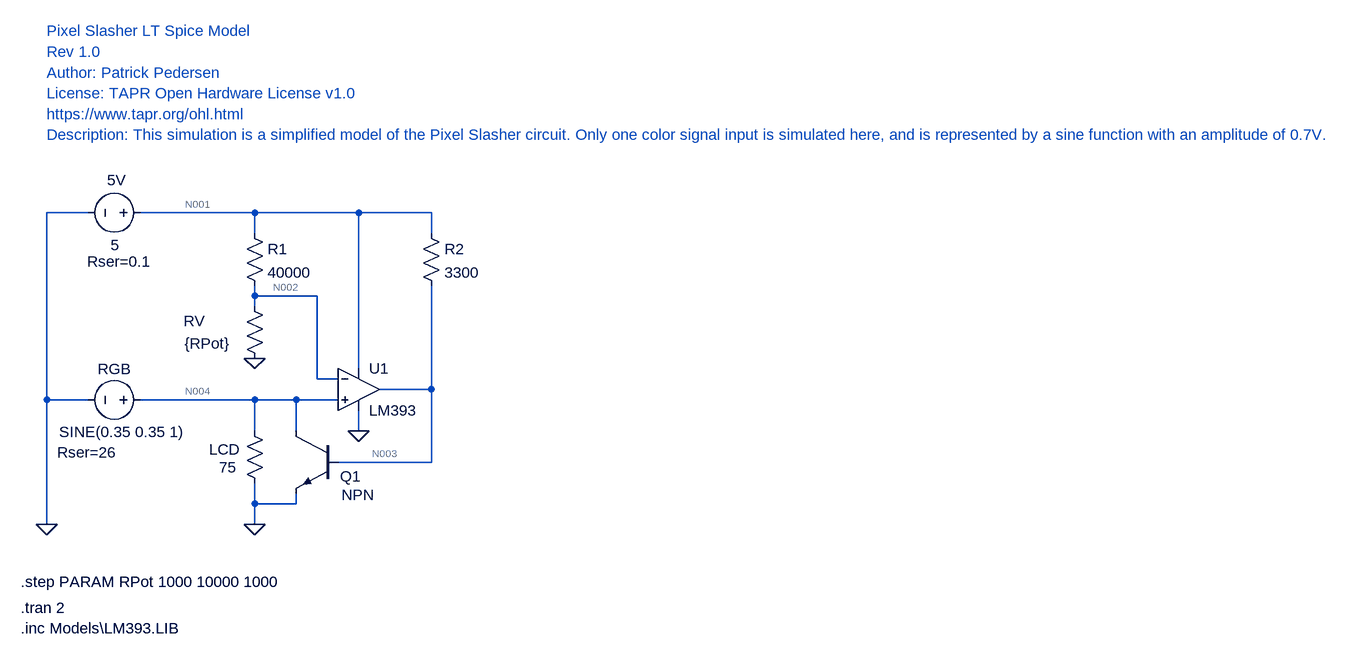
[diagram p0: schematic PixelSlasher.asc]
PixelSlasher.asc, the LTspice schematic file:
Version 4
SHEET 1 1868 688
WIRE -224 32 -288 32
WIRE 32 32 -144 32
WIRE 192 32 32 32
WIRE 304 32 192 32
WIRE 32 64 32 32
WIRE 304 64 304 32
WIRE 32 160 32 144
WIRE 128 160 32 160
WIRE 32 176 32 160
WIRE 192 272 192 32
WIRE 128 288 128 160
WIRE 160 288 128 288
WIRE 304 304 304 144
WIRE 304 304 224 304
WIRE -288 320 -288 32
WIRE -224 320 -288 320
WIRE 32 320 -144 320
WIRE 96 320 32 320
WIRE 160 320 96 320
WIRE 32 368 32 320
WIRE 96 368 96 320
WIRE 192 368 192 336
WIRE 304 416 304 304
WIRE 304 416 160 416
WIRE 32 480 32 448
WIRE 96 480 96 464
WIRE 96 480 32 480
WIRE -288 512 -288 320
WIRE 32 512 32 480
FLAG -288 512 0
FLAG 32 256 0
FLAG 192 368 0
FLAG 32 512 0
SYMBOL voltage -128 32 R90
WINDOW 0 -50 38 VRight 2
WINDOW 3 50 48 VRight 2
WINDOW 123 0 0 Left 0
WINDOW 39 75 -1 VRight 2
SYMATTR InstName 5V
SYMATTR Value 5
SYMATTR SpiceLine Rser=0.1
SYMBOL voltage -128 320 R90
WINDOW 0 -32 56 VBottom 2
WINDOW 3 34 44 VTop 2
WINDOW 123 0 0 Left 0
WINDOW 39 65 98 VTop 2
SYMATTR InstName RGB
SYMATTR Value SINE(0.35 0.35 1)
SYMATTR SpiceLine Rser=26
SYMBOL res 16 48 R0
SYMATTR InstName R1
SYMATTR Value 40000
SYMBOL res 16 160 R0
WINDOW 0 -93 39 Left 2
WINDOW 3 -92 73 Left 2
SYMATTR InstName RV
SYMATTR Value {RPot}
SYMBOL npn 160 368 M0
WINDOW 0 -36 70 Left 2
WINDOW 3 -56 98 Left 2
SYMATTR InstName Q1
SYMBOL res 16 352 R0
WINDOW 0 -54 44 Left 2
WINDOW 3 -39 72 Left 2
SYMATTR InstName LCD
SYMATTR Value 75
SYMBOL res 288 48 R0
SYMATTR InstName R2
SYMATTR Value 3300
SYMBOL Opamps\\opamp2 192 240 R0
SYMATTR InstName U1
SYMATTR Value LM393
TEXT -328 600 Left 2 !.step PARAM RPot 1000 10000 1000
TEXT -328 640 Left 2 !.tran 2
TEXT -328 672 Left 2 !.inc Models\\LM393.LIB
TEXT -288 -216 Left 2 ;Rev 1.0
TEXT -288 -248 Left 2 ;Pixel Slasher LT Spice Model
TEXT -288 -184 Left 2 ;Author: Patrick Pedersen
TEXT -288 -152 Left 2 ;License: TAPR Open Hardware License v1.0
TEXT -288 -120 Left 2 ;https://www.tapr.org/ohl.html
TEXT -288 -88 Left 2 ;Description: This simulation is a simplified model of the Pixel Slasher circuit. Only one color signal input is simulated here, and is represented by a sine function with an amplitude of 0.7V.

The netlist it stands for:
* PixelSlasher.asc
V§5V N001 0 5 Rser=0.1
V§RGB N004 0 SINE(0.35 0.35 1) Rser=26
R1 N001 N002 40000
RV N002 0 {RPot}
Q1 N004 N003 0 0 NPN
R§LCD N004 0 75
R2 N001 N003 3300
XU1 N004 N002 N001 0 N003 LM393  ; pins In+ In- V+ V- OUT
.model NPN NPN
.model PNP PNP
.lib standard.bjt
.step PARAM RPot 1000 10000 1000
.tran 2
.inc Models\LM393.LIB
* Rev 1.0
* Pixel Slasher LT Spice Model
* Author: Patrick Pedersen
* License: TAPR Open Hardware License v1.0
* https://www.tapr.org/ohl.html
* Description: This simulation is a simplified model of the Pixel Slasher circuit. Only one color signal input is simulated here, and is represented by a sine function with an amplitude of 0.7V.
.backanno
.end

* Results of the author's LTspice run, read from the files saved beside the schematic
* Operating Point (first step), zero values left out:
*   rpot = 1 k
*   V(n001) = 5 V
*   V(n004) = 122 mV
*   V(n002) = 122 mV
*   V(n003) = 825.6 mV
*   Ic(Q1) = 7.143 mA
*   Ib(Q1) = 137.8 µA
*   Ie(Q1) = -7.281 mA
*   I(R2) = 1.265 mA
*   I(Lcd) = 1.627 mA
*   I(Rv) = 122 µA
*   I(R1) = 121.9 µA
*   I(Rgb) = -8.769 mA
*   I(5v) = -1.595 mA
*   Ix(u1:1) = -24.98 nA
*   Ix(u1:2) = -25 nA
*   Ix(u1:3) = 207.9 µA
*   Ix(u1:4) = -1.335 mA
*   Ix(u1:5) = 1.127 mA
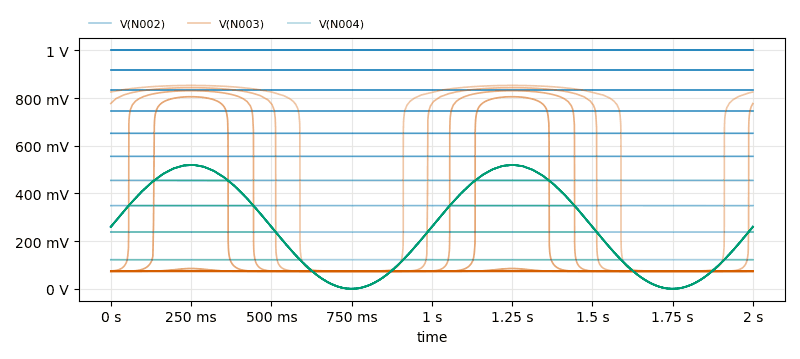
[diagram p1: Transient Analysis of PixelSlasher.asc, plotted from the saved traces]
* Transient Analysis, 10 runs:
*   V(N002) [rpot=1000]: min 121.9 mV, max 122 mV, average 122 mV, rms 122 mV, last 122 mV
*   V(N002) [rpot=2000]: min 238.1 mV, max 238.1 mV, average 238.1 mV, rms 238.1 mV, last 238.1 mV
*   V(N002) [rpot=3000]: min 348.8 mV, max 348.9 mV, average 348.9 mV, rms 348.9 mV, last 348.8 mV
*   V(N002) [rpot=4000]: min 454.5 mV, max 454.6 mV, average 454.6 mV, rms 454.6 mV, last 454.5 mV
*   V(N002) [rpot=5000]: min 555.5 mV, max 555.6 mV, average 555.5 mV, rms 555.5 mV, last 555.5 mV
*   V(N002) [rpot=6000]: min 652.2 mV, max 652.2 mV, average 652.2 mV, rms 652.2 mV, last 652.2 mV
*   V(N002) [rpot=7000]: min 744.7 mV, max 744.7 mV, average 744.7 mV, rms 744.7 mV, last 744.7 mV
*   V(N002) [rpot=8000]: min 833.3 mV, max 833.3 mV, average 833.3 mV, rms 833.3 mV, last 833.3 mV
*   V(N003) [rpot=1000]: min 73.61 mV, max 853 mV, average 590.4 mV, rms 687.3 mV, last 825.6 mV
*   V(N003) [rpot=2000]: min 73.21 mV, max 843.6 mV, average 471.2 mV, rms 601.5 mV, last 777.3 mV
*   V(N003) [rpot=3000]: min 73.2 mV, max 830.6 mV, average 362.9 mV, rms 510.9 mV, last 74.67 mV
*   V(N003) [rpot=4000]: min 73.2 mV, max 805.7 mV, average 241.1 mV, rms 385.2 mV, last 73.23 mV
*   V(N003) [rpot=5000]: min 73.2 mV, max 85.05 mV, average 74.71 mV, rms 74.78 mV, last 73.2 mV
*   V(N003) [rpot=6000]: min 73.2 mV, max 73.48 mV, average 73.24 mV, rms 73.24 mV, last 73.2 mV
*   V(N003) [rpot=7000]: min 73.2 mV, max 73.21 mV, average 73.2 mV, rms 73.2 mV, last 73.2 mV
*   V(N003) [rpot=8000]: min 73.2 mV, max 73.2 mV, average 73.2 mV, rms 73.2 mV, last 73.2 mV
*   V(N004) [rpot=1000]: min 960.3 nV, max 122 mV, average 96.28 mV, rms 105.4 mV, last 122 mV
*   V(N004) [rpot=2000]: min 984 nV, max 238.2 mV, average 166 mV, rms 189.5 mV, last 238.2 mV
*   V(N004) [rpot=3000]: min 1.41 µV, max 348.9 mV, average 216.8 mV, rms 255.9 mV, last 259.9 mV
*   V(N004) [rpot=4000]: min 3.385 µV, max 454.6 mV, average 250 mV, rms 303.3 mV, last 259.9 mV
*   V(N004) [rpot=5000]: min 1.071 µV, max 519.6 mV, average 259.7 mV, rms 318.9 mV, last 259.9 mV
*   V(N004) [rpot=6000]: min 1.071 µV, max 519.8 mV, average 259.6 mV, rms 318.8 mV, last 259.9 mV
*   V(N004) [rpot=7000]: min 1.071 µV, max 519.8 mV, average 259.6 mV, rms 318.8 mV, last 259.9 mV
*   V(N004) [rpot=8000]: min 1.071 µV, max 519.8 mV, average 259.6 mV, rms 318.8 mV, last 259.9 mV